# EAGLE schematic LINC (EAGLE 5.11)
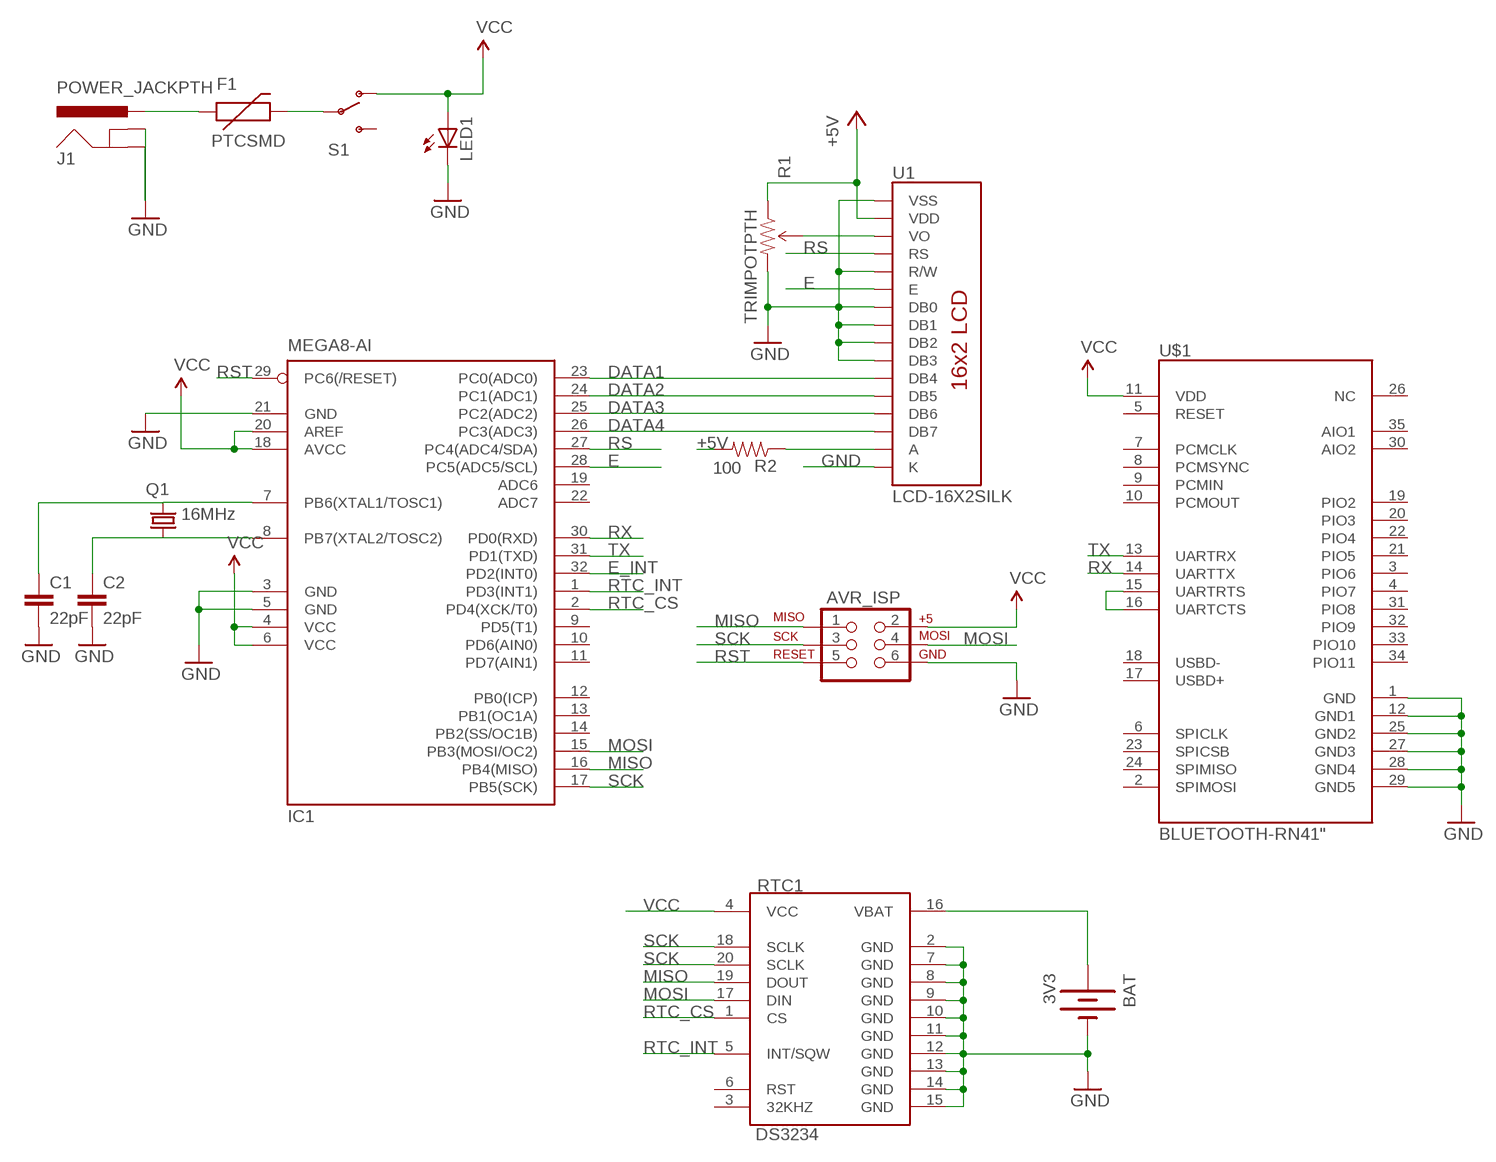
[diagram p0: schematic, sheet 1]

## Parts
AVR_ISP  AVR_SPI_PRG_6PTH  [2X3]
BAT  3V3  BATTERY12PTH  [BATTCON_12MM_PTH]
C1  22pF  C-EU025-025X050  [C025-025X050]
C2  22pF  C-EU025-025X050  [C025-025X050]
F1  PTCSMD  [PTC-1206]
IC1  MEGA8-AI  [TQFP32-08]
J1  POWER_JACKPTH  [POWER_JACK_PTH]
LED1  LED5MM  [LED5MM]
Q1  16MHz  CRYSTALHC49S  [HC49/S]
R1  TRIMPOTPTH  [TRIM_POT_PTH]
R2  100  RESISTORPTH-1/4W  [AXIAL-0.4]
RTC1  DS3234  [DS3234]
S1  SWITCH-SPSTPTH  [SWITCH-SPDT]
U1  LCD-16X2SILK  [LCD-16X2]
U$1  BLUETOOTH-RN41"  [RN41]

## Nets
+5V: R1.1(CCW) R2.P$2 U1.2(VDD)
DATA1: U1.11(DB4)
DATA2: U1.12(DB5)
DATA3: U1.13(DB6)
DATA4: U1.14(DB7)
E: U1.6(E)
E_INT: IC1.32(PD2(INT0))
GND: AVR_ISP.6 BAT.GND(-) C1.2 C2.2 IC1.3(GND) IC1.5(GND) IC1.21(GND) J1.GND J1.GNDBREAK LED1.K(C) R1.3(CW) RTC1.2(GND) RTC1.7(GND) RTC1.8(GND) RTC1.9(GND) RTC1.10(GND) RTC1.11(GND) RTC1.12(GND) RTC1.13(GND) RTC1.14(GND) RTC1.15(GND) U1.1(VSS) U1.5(R/W) U1.7(DB0) U1.8(DB1) U1.9(DB2) U1.10(DB3) U1.16(K) U$1.1(GND) U$1.12(GND1) U$1.25(GND2) U$1.27(GND3) U$1.28(GND4) U$1.29(GND5)
MISO: AVR_ISP.1 IC1.16(PB4(MISO)) RTC1.19(DOUT)
MOSI: AVR_ISP.4 IC1.15(PB3(MOSI/OC2)) RTC1.17(DIN)
N$1: U$1.15(UARTRTS) U$1.16(UARTCTS)
N$2: C1.1 IC1.7(PB6(XTAL1/TOSC1)) Q1.2
N$4: C2.1 IC1.8(PB7(XTAL2/TOSC2)) Q1.1
N$8: F1.2 S1.2(P)
N$9: F1.1 J1.PWR
N$16: R1.2(WIPER) U1.3(VO)
N$20: BAT.VCC@1(+) RTC1.16(VBAT)
N$27: R2.P$1 U1.15(A)
RS: U1.4(RS)
RST: AVR_ISP.5 IC1.29(PC6(/RESET))
RTC_CS: IC1.2(PD4(XCK/T0)) RTC1.1(CS)
RTC_INT: IC1.1(PD3(INT1)) RTC1.5(INT/SQW)
RX: IC1.30(PD0(RXD)) U$1.14(UARTTX)
SCK: AVR_ISP.3 IC1.17(PB5(SCK)) RTC1.18(SCLK) RTC1.20(SCLK)
TX: IC1.31(PD1(TXD)) U$1.13(UARTRX)
VCC: AVR_ISP.2 IC1.4(VCC) IC1.6(VCC) IC1.18(AVCC) IC1.20(AREF) LED1.A RTC1.4(VCC) S1.1(O) U$1.11(VDD)
Unconnected: IC1.9(PD5(T1)) IC1.10(PD6(AIN0)) IC1.11(PD7(AIN1)) IC1.12(PB0(ICP)) IC1.13(PB1(OC1A)) IC1.14(PB2(SS/OC1B)) IC1.19(ADC6) IC1.22(ADC7) IC1.23(PC0(ADC0)) IC1.24(PC1(ADC1)) IC1.25(PC2(ADC2)) IC1.26(PC3(ADC3)) IC1.27(PC4(ADC4/SDA)) IC1.28(PC5(ADC5/SCL)) RTC1.3(32KHZ) RTC1.6(RST) S1.3(S) U$1.2(SPIMOSI) U$1.3(PIO6) U$1.4(PIO7) U$1.5(RESET) U$1.6(SPICLK) U$1.7(PCMCLK) U$1.8(PCMSYNC) U$1.9(PCMIN) U$1.10(PCMOUT) U$1.17(USBD+) U$1.18(USBD-) U$1.19(PIO2) U$1.20(PIO3) U$1.21(PIO5) U$1.22(PIO4) U$1.23(SPICSB) U$1.24(SPIMISO) U$1.26(NC) U$1.30(AIO2) U$1.31(PIO8) U$1.32(PIO9) U$1.33(PIO10) U$1.34(PIO11) U$1.35(AIO1)

## Library data of the parts
AVR_ISP = SparkFun:AVR_SPI_PRG_6: AVR ISP 6 Pin This is the reduced ISP connector for AVR programming. Common on Arduino. This footprint will take up less PCB space and can be used with a 10-pin to 6-pin adapter such as SKU: BOB-08508
BAT = SparkFun:BATTERY: Battery Holders Various common sizes : AA, AAA, 20mm coin cell and 12mm coin cell.
C1 C2 = resistor:C-EU: CAPACITOR, European symbol
F1 = SparkFun:PTC: Resettable Fuse PTC Resettable Fuse. Spark Fun Electronics SKU : COM-08357
IC1 = atmel:MEGA8: MICROCONTROLLER 8 Kbytes FLASH, 1 kbytes SRAM, 512 bytes EEPROM, USART, 6-channel 10 bit ADC, 2-channel 8 bit ADC Pin compatible with Atmega48, ATMega88, ATMega168 Source: avr.lbr; MPN: ATMEGA8-16AU; OC_FARNELL: 9171371; OC_NEWARK: 73M8863
J1 = SparkFun:POWER_JACK: Power Jack This is the standard 5.5mm barrel jack for power. The PTH is the most common, proven, reliable, footprint. All others are experimental. The Slot footprint only works if the mill layer is transmitted to the PCB fab house so be warned. Spark Fun Electronics SKU : PRT-00119. Mating wall wart : TOL-00298 (and others)
LED1 = SparkFun:LED: LEDs Standard schematic elements and footprints for 5mm, 3mm, 1206, and 0603 sized LEDs. 5mm - Spark Fun Electronics SKU : COM-00529 (and others)
Q1 = crystal:CRYSTAL: CRYSTAL; OC_FARNELL: 1667008; OC_NEWARK: unknown
R1 = SparkFun:TRIMPOT
R2 = SparkFun:RESISTOR: Resistor Basic schematic elements and footprints for 0603, 1206, and PTH resistors.
RTC1 = SparkFun:DS3234: DS3234 Real Time Clock
S1 = SparkFun:SWITCH-SPST: SPST Switch Simple slide switch. Spark Fun Electronics SKU : COM-00102
U1 = SparkFun:LCD-16X2
U$1 = SparkFun:BLUETOOTH-RN41